# EAGLE design RedBoard-v21 (EAGLE 7.1.0)
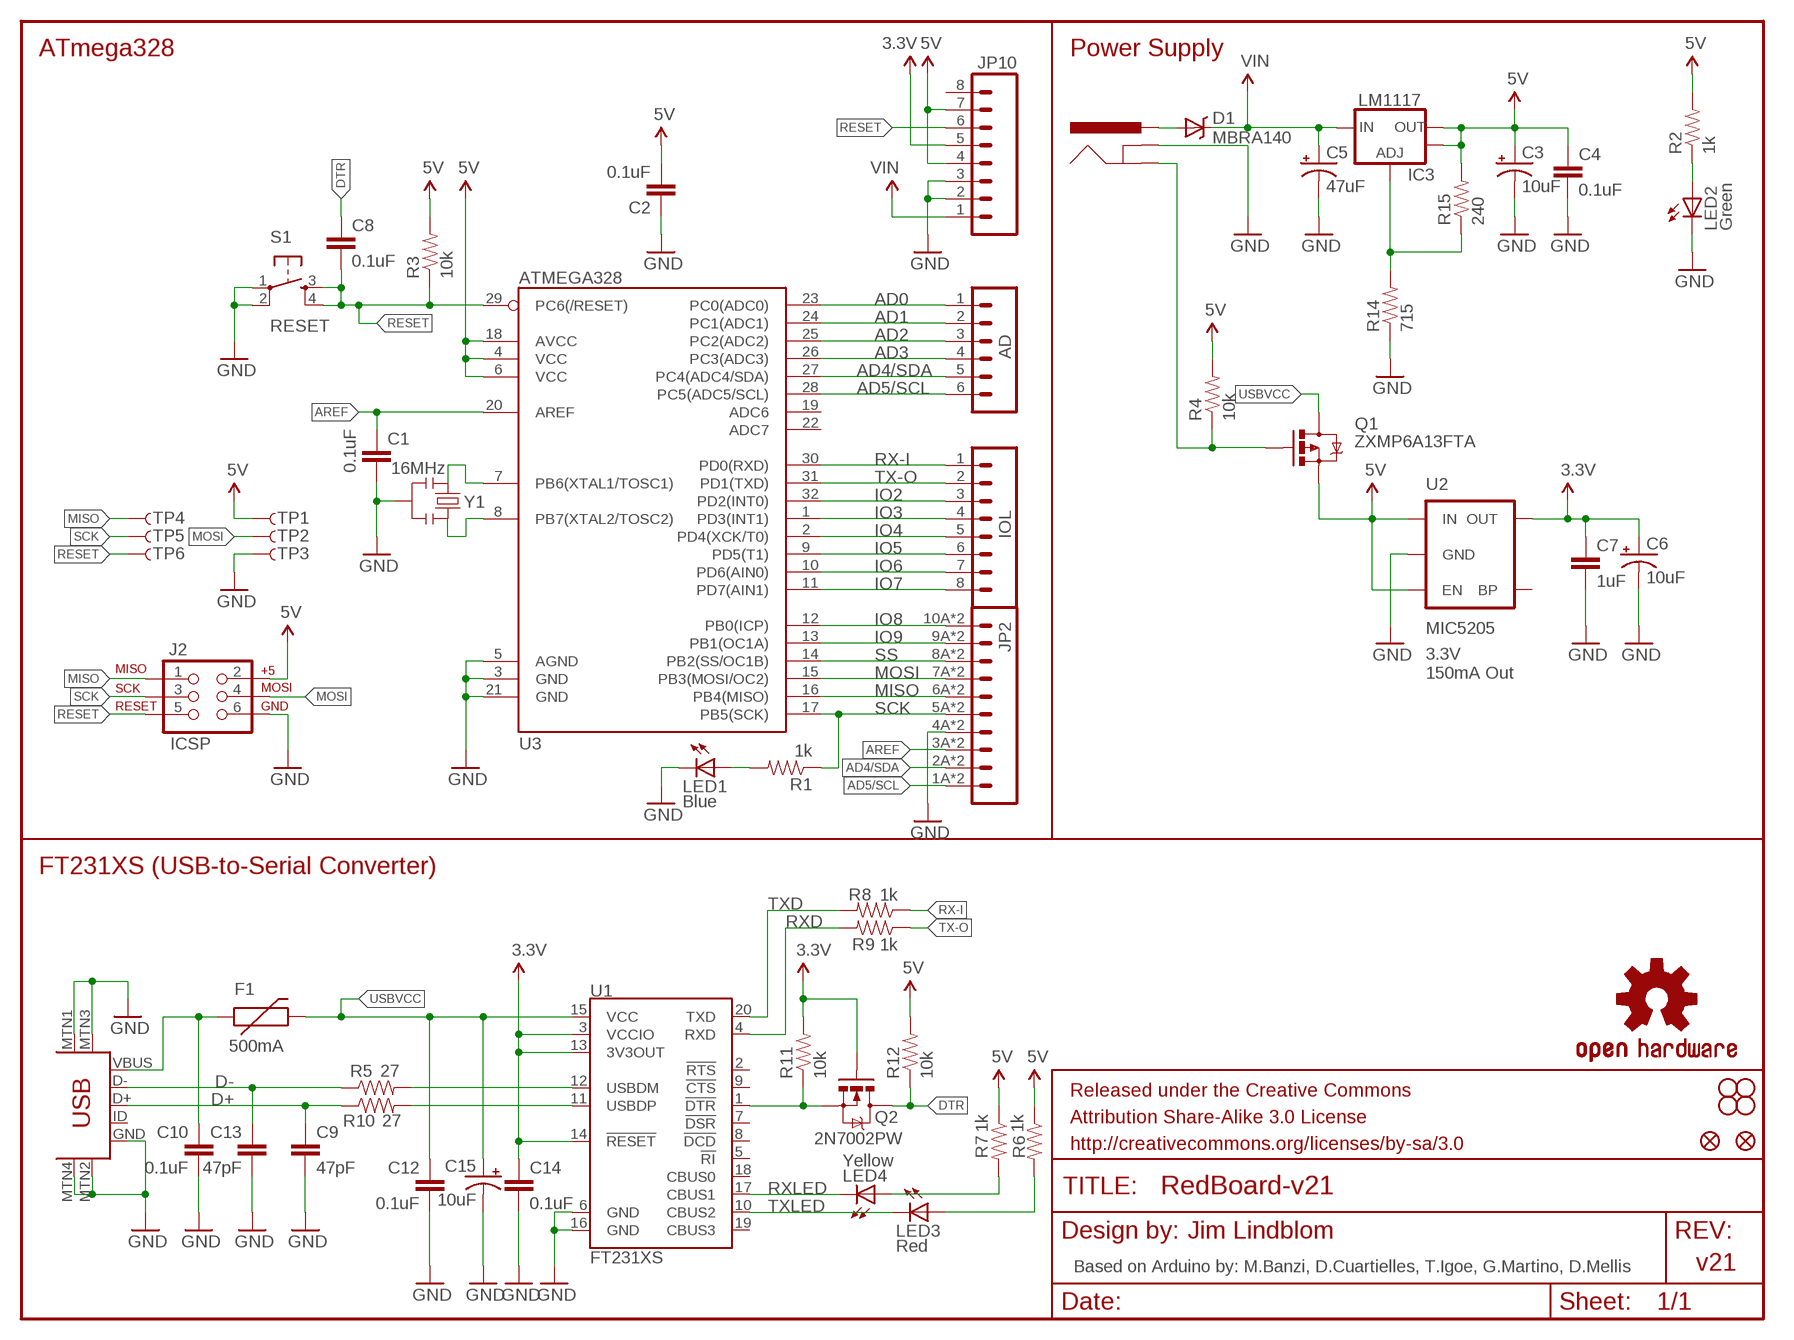
[diagram p0: schematic, sheet 1]

## Parts
AD  M06SMD-STRAIGHT-COMBO  [1X06_SMD_STRAIGHT_COMBO]
C1  0.1uF  CAP0603-CAP  [0603-CAP]
C2  0.1uF  CAP0603-CAP  [0603-CAP]
C3  10uF  CAP_POL1206  [EIA3216]
C4  0.1uF  CAP0603-CAP  [0603-CAP]
C5  47uF  CAP_POLD  [PANASONIC_D]
C6  10uF  CAP_POL1206  [EIA3216]
C7  1uF  CAP0603-CAP  [0603-CAP]
C8  0.1uF  CAP0603-CAP  [0603-CAP]
C9  47pF  47PF-50V-5%(0603)  [0603-CAP]
C10  0.1uF  CAP0603-CAP  [0603-CAP]
C12  0.1uF  CAP0603-CAP  [0603-CAP]
C13  47pF  47PF-50V-5%(0603)  [0603-CAP]
C14  0.1uF  CAP0603-CAP  [0603-CAP]
C15  10uF  CAP_POL1206  [EIA3216]
D1  MBRA140  DIODE-SCHOTTKY_  [SMA-DIODE]
F1  500mA  PTCSMD  [PTC-1206]
FRAME2  FRAME-LETTER  [CREATIVE_COMMONS]
IC3  LM1117  V_REG_LM1117ALT1  [SOT223-ALT1]
IOL  M08SMD-COMBO  [1X08_SMD_COMBINED]
J1  POWER_JACKOVERPASTE_REDBOARD_0603  [POWER_JACK_SMD_OVERPASTE_REDBOARD_0603]
J2  ICSP  AVR_SPI_PRG_6SMT_MALE  [2X3_SMT_POSTS]
JP2  M10SMD_COMBO  [1X10_SMD_COMBINED]
JP3  STAND-OFF  [STAND-OFF]
JP4  STAND-OFF  [STAND-OFF]
JP5  STAND-OFF  [STAND-OFF]
JP6  STAND-OFF  [STAND-OFF]
JP8  FIDUCIAL1X2  [FIDUCIAL-1X2]
JP9  FIDUCIAL1X2  [FIDUCIAL-1X2]
JP10  M08SMD-COMBO  [1X08_SMD_COMBINED]
LED1  Blue  LED1206-NS  [LED-1206-NO_SILK]
LED2  Green  LED1206-NS  [LED-1206-NO_SILK]
LED3  Red  LED1206-NS  [LED-1206-NO_SILK]
LED4  Yellow  LED1206-NS  [LED-1206-NO_SILK]
Q1  ZXMP6A13FTA  MOSFET-PCHANNELSMD  [SOT23-3]
Q2  2N7002PW  MOSFET-NCHANNEL2N7002PW  [SOT323]
R1  1k  RESISTOR0603-RES  [0603-RES]
R2  1k  RESISTOR0603-RES  [0603-RES]
R3  10k  RESISTOR0603-RES  [0603-RES]
R4  10k  RESISTOR0603-RES  [0603-RES]
R5  27  RESISTOR0603-RES  [0603-RES]
R6  1k  RESISTOR0603-RES  [0603-RES]
R7  1k  RESISTOR0603-RES  [0603-RES]
R8  1k  RESISTOR0603-RES  [0603-RES]
R9  1k  RESISTOR0603-RES  [0603-RES]
R10  27  RESISTOR0603-RES  [0603-RES]
R11  10k  RESISTOR0603-RES  [0603-RES]
R12  10k  RESISTOR0603-RES  [0603-RES]
R14  715  RESISTOR0603-RES  [0603-RES]
R15  240  RESISTOR0603-RES  [0603-RES]
S1  RESET  TAC_SWITCHSMD  [TACTILE_SWITCH_SMD]
TP1  TP-3x5  TEST-POINT3X5  [PAD.03X.05]
TP2  TP-3x5  TEST-POINT3X5  [PAD.03X.05]
TP3  TP-3x5  TEST-POINT3X5  [PAD.03X.05]
TP4  TP-3x5  TEST-POINT3X5  [PAD.03X.05]
TP5  TP-3x5  TEST-POINT3X5  [PAD.03X.05]
TP6  TP-3x5  TEST-POINT3X5  [PAD.03X.05]
U1  FT231XS  [SSOP20_L]
U2  MIC5205  V_REG_LDOSMD  [SOT23-5]
U3  ATMEGA328  ATMEGA168  [TQFP32-08]
U$13  USB-MINIB-5PIN  [USB-MINIB]
U$16  OSHW-LOGOS  [OSHW-LOGO-S]
Y1  16MHz  RESONATORSMD  [RESONATOR-SMD]

## Nets
3.3V: C6.A(+) C7.1 C14.1 JP10.5 Q2.1(G) R11.2 U1.3(VCCIO) U1.13(3V3OUT) U1.14(!RESET) U2.5(OUT)
5V: C2.2 C3.A(+) C4.1 IC3.2(OUT) IC3.4(OUT) J2.2 JP10.4 JP10.7 Q1.2(S) R2.2 R3.2 R4.2 R6.1 R7.1 R12.2 R15.2 TP1.P$1 U2.1(IN) U2.3(EN) U3.4(VCC) U3.6(VCC) U3.18(AVCC)
AD0: AD.1 U3.23(PC0(ADC0))
AD1: AD.2 U3.24(PC1(ADC1))
AD2: AD.3 U3.25(PC2(ADC2))
AD3: AD.4 U3.26(PC3(ADC3))
AD4/SDA: AD.5 JP2.2A JP2.2B U3.27(PC4(ADC4/SDA))
AD5/SCL: AD.6 JP2.1A JP2.1B U3.28(PC5(ADC5/SCL))
AREF: C1.1 JP2.3A JP2.3B U3.20(AREF)
D+: C9.1 R10.1 U$13.D+
D-: C13.1 R5.1 U$13.D-
DTR: C8.1 Q2.3(D) R12.1
GND: C1.2 C2.1 C3.C(-) C4.2 C5.- C6.C(-) C7.2 C9.2 C10.2 C12.2 C13.2 C14.2 C15.C(-) J1.GND(GNDBREAK) J2.6 JP2.4A JP2.4B JP10.2 JP10.3 LED1.C LED2.C R14.1 S1.1 S1.2 TP3.P$1 U1.6(GND) U1.16(GND) U2.2(GND) U3.3(GND) U3.5(AGND) U3.21(GND) U$13.GND U$13.MTN1(MTN2) U$13.MTN2(MTN3) U$13.MTN3(MTN1) U$13.MTN4 Y1.2
INSERT: J1.P$4(GND) Q1.1(G) R4.1
IO2: IOL.3 U3.32(PD2(INT0))
IO3: IOL.4 U3.1(PD3(INT1))
IO4: IOL.5 U3.2(PD4(XCK/T0))
IO5: IOL.6 U3.9(PD5(T1))
IO6: IOL.7 U3.10(PD6(AIN0))
IO7: IOL.8 U3.11(PD7(AIN1))
IO8: JP2.10A JP2.10B U3.12(PB0(ICP))
IO9: JP2.9A JP2.9B U3.13(PB1(OC1A))
MISO: J2.1 JP2.6A JP2.6B TP4.P$1 U3.16(PB4(MISO))
MOSI: J2.4 JP2.7A JP2.7B TP2.P$1 U3.15(PB3(MOSI/OC2))
N$1: LED1.A R1.2
N$2: LED2.A R2.1
N$3: U3.7(PB6(XTAL1/TOSC1)) Y1.1
N$4: U3.8(PB7(XTAL2/TOSC2)) Y1.3
N$6: R5.2 U1.12(USBDM)
N$7: R10.2 U1.11(USBDP)
N$8: LED3.A R6.2
N$10: LED4.A R7.2
N$12: Q2.2(S) R11.1 U1.1(!DTR)
N$15: IC3.1(ADJ) R14.2 R15.1
PWRIN: D1.A J1.VIN0(PWR)
RESET: C8.2 J2.5 JP10.6 R3.1 S1.3 S1.4 TP6.P$1 U3.29(PC6(/RESET))
RX-I: IOL.1 R8.1 U3.30(PD0(RXD))
RXD: R9.2 U1.4(RXD)
RXLED: LED4.C U1.17(CBUS1)
SCK: J2.3 JP2.5A JP2.5B R1.1 TP5.P$1 U3.17(PB5(SCK))
SS: JP2.8A JP2.8B U3.14(PB2(SS/OC1B))
TX-O: IOL.2 R9.1 U3.31(PD1(TXD))
TXD: R8.2 U1.20(TXD)
TXLED: LED3.C U1.10(CBUS2)
USBVCC: C12.1 C15.A(+) F1.2 Q1.3(D) U1.15(VCC)
VIN: C5.+ D1.C IC3.3(IN) JP10.1
VUSB: C10.1 F1.1 U$13.VBUS
Unconnected: JP10.8 U1.2(!RTS) U1.5(!RI) U1.7(!DSR) U1.8(!DCD) U1.9(!CTS) U1.18(CBUS0) U1.19(CBUS3) U2.4(BP) U3.19(ADC6) U3.22(ADC7) U$13.ID

## Notes on the sheet
- ATmega328 | Power Supply
- 3.3V
  150mA Out
- FT231XS (USB-to-Serial Converter)
- Jim Lindblom
- Based on Arduino by: M.Banzi, D.Cuartielles, T.Igoe, G.Martino, D.Mellis | v21

## Library data of the parts
AD = SparkFun:M06: Header 6 Standard 6-pin 0.1" header. Use with straight break away headers (SKU : PRT-00116), right angle break away headers (PRT-00553), swiss pins (PRT-00743), machine pins (PRT-00117), and female headers (PRT-00115). Molex polarized connector foot print use with SKU : PRT-08094 with associated crimp pins and housings. NOTES ON THE VARIANTS LOCK and LOCK_LONGPADS... This footprint was designed to help hold the alignment of a through-hole component (i.e. 6-pin header) while soldering it into place. You may notice that each hole has been shifted either up or down by 0.005 of an inch from it's more standard position (which is a perfectly straight line). This slight alteration caused the pins (the squares in the middle) to touch the edges of the holes. Because they are alternating, it causes a "brace" to hold the component in place. 0.005 has proven to be the perfect amount of "off-center" position when using our standard breakaway headers. Although looks a little odd when you look at the bare footprint, once you have a header in there, the alteration is very hard to notice. Also, if you push a header all the way into place, it is covered up entirely on the bottom side. This idea of altering the position of holes to aid alignment will be further integrated into the Sparkfun Library for other footprints. It can help hold any component with 3 or more connection pins.
C1 C2 C4 C7 C8 C10 C12 C14 = SparkFun:CAP: Capacitor Standard 0603 ceramic capacitor, and 0.1" leaded capacitor.
C3 C5 C6 = SparkFun:CAP_POL: Capacitor Polarized These are standard SMD and PTH capacitors. Normally 10uF, 47uF, and 100uF in electrolytic and tantalum varieties. Always verify the external diameter of the through hole cap, it varies with capacity, voltage, and manufacturer. The EIA devices should be standard.
C9 C13 = SparkFun-Capacitors:47PF-50V-5%(0603): CAP-08913; PROD_ID: CAP-08913
C15 = SparkFun-Capacitors:CAP_POL: Capacitor Polarized These are standard SMD and PTH capacitors. Normally 10uF, 47uF, and 100uF in electrolytic and tantalum varieties. Always verify the external diameter of the through hole cap, it varies with capacity, voltage, and manufacturer. The EIA devices should be standard.
D1 = SparkFun:DIODE-SCHOTTKY
F1 = SparkFun:PTC: Resettable Fuse PTC Resettable Fuse. Spark Fun Electronics SKU : COM-08357
FRAME2 = SparkFun-Aesthetics:FRAME-LETTER: Schematic Frame Standard 8.5x11 US Letter frame
IC3 = Testing:V_REG_LM1117: Voltage Regulator LM1117 Standard adjustable voltage regulator but in SMD form. Spark Fun Electronics SKU : COM-00595
IOL = SparkFun:M08: Header 8 Standard 8-pin 0.1" header. Use with straight break away headers (SKU : PRT-00116), right angle break away headers (PRT-00553), swiss pins (PRT-00743), machine pins (PRT-00117), and female headers (PRT-00115).
J1 = Testing:POWER_JACK: Power Jack This is the standard 5.5mm barrel jack for power. The PTH is the most common, proven, reliable, footprint. All others are experimental. The Slot footprint only works if the mill layer is transmitted to the PCB fab house so be warned. Spark Fun Electronics SKU : PRT-00119. Mating wall wart : TOL-00298 (and others)
J2 = SparkFun-Connectors:AVR_SPI_PRG_6: AVR ISP 6 Pin This is the reduced ISP connector for AVR programming. Common on Arduino. This footprint will take up less PCB space and can be used with a 10-pin to 6-pin adapter such as SKU: BOB-08508
JP2 = SparkFun-Connectors:M10: Header 10 Standard 10-pin 0.1" header. Use with straight break away headers (SKU : PRT-00116), right angle break away headers (PRT-00553), swiss pins (PRT-00743), machine pins (PRT-00117), and female headers (PRT-00115).
JP3-JP6 = SparkFun:STAND-OFF: Stand Off This is the mechanical footprint for a #4 phillips button head screw. Use the keepout ring to avoid running the screw head into surrounding components. SKU : PRT-00447
JP8 JP9 = SparkFun:FIDUCIAL: Fiducial Alignment Points Various fiducial points for machine vision alignment.
JP10 = SparkFun-Connectors:M08: Header 8 Standard 8-pin 0.1" header. Use with straight break away headers (SKU : PRT-00116), right angle break away headers (PRT-00553), swiss pins (PRT-00743), machine pins (PRT-00117), and female headers (PRT-00115).
LED1-LED4 = SparkFun-LED:LED: LEDs Standard schematic elements and footprints for 5mm, 3mm, 1206, and 0603 sized LEDs. 5mm - Spark Fun Electronics SKU : COM-00529 (and others)
Q1 = SparkFun:MOSFET-PCHANNEL
Q2 = SparkFun-DiscreteSemi:MOSFET-NCHANNEL: Common NMOSFET Parts MFG P/N Store ID Prod ID FDD8780 TRANS-09984 SI7820DN TRANS-11055 FDS6630A IC-08089 2N7002PW TRANS-11151 FQP30N06L COM-10213 TRANS-10060 BSS123LT1G TRANS-08345 BSS138 TRANS-00830 BS170 2N7000; PROD_ID: TRANS-11151
R1-R4 R6-R9 R11 R12 R14 R15 = SparkFun:RESISTOR: Resistor Basic schematic elements and footprints for 0603, 1206, and PTH resistors.
R5 R10 = SparkFun-Resistors:RESISTOR: Resistor Basic schematic elements and footprints for 0603, 1206, and PTH resistors.
S1 = SparkFun:TAC_SWITCH: Momentary Switch Button commonly used for reset or general input. Spark Fun Electronics SKU : COM-00097
TP1-TP6 = SparkFun-Passives:TEST-POINT: Bare copper test points for troubleshooting or ICT
U1 = SparkFun-DigitalIC:FT231X: FTDI FT231X Full Speed USB to Full-handshake UART This USB2.0 Full Speed IC offers a compact bridge to full handshake UART interfaces. The device is a UART, capable of operating up to 3MBaud, with low power consumption (8mA). The FT231X includes the complete FT-X series feature set and enables USB to be added into a system design quickly and easily over a UART interface.
U2 = SparkFun:V_REG_LDO: Voltage Regulator LDO Standard 150mA LDO voltage regulator in SOT-23 layout. Micrel part MIC5205. BP (by-pass) pin is used to lower output noise with 470pF cap.
U3 = SparkFun:ATMEGA168
U$13 = SparkFun-Connectors:USB-MINIB: Mini-USB "B" connector with 5th pin broken out. Created new symbol breaking out 5th "ID" pin in mini/micro USB connector spec. See: http://en.wikipedia.org/wiki/Mini_usb#Cables. Uses same footprint as 4-pin symbol. Also added pins to connect to mounting / shield pads if required (probably not generally needed as signals aren't shielded once they leave the connector).
U$16 = SparkFun-Aesthetics:OSHW-LOGO: Open Source Hardware Logo This logo indicates the piece of hardware it is found on incorporates a OSHW license and/or adheres to the definition of open source hardware found here: http://freedomdefined.org/OSHW
Y1 = SparkFun-FreqCtrl:RESONATOR: Resonator Small SMD resonator. This is the itty bitty 10/20MHz resonators with built in caps. CSTCE10M0G55 and CSTCE20M0V53. Footprint has been reviewed closely but hasn't been tested yet.

## Net classes
0 default: width 0.152 mm, drill 0.305 mm, clearance 0.152 mm

## Board
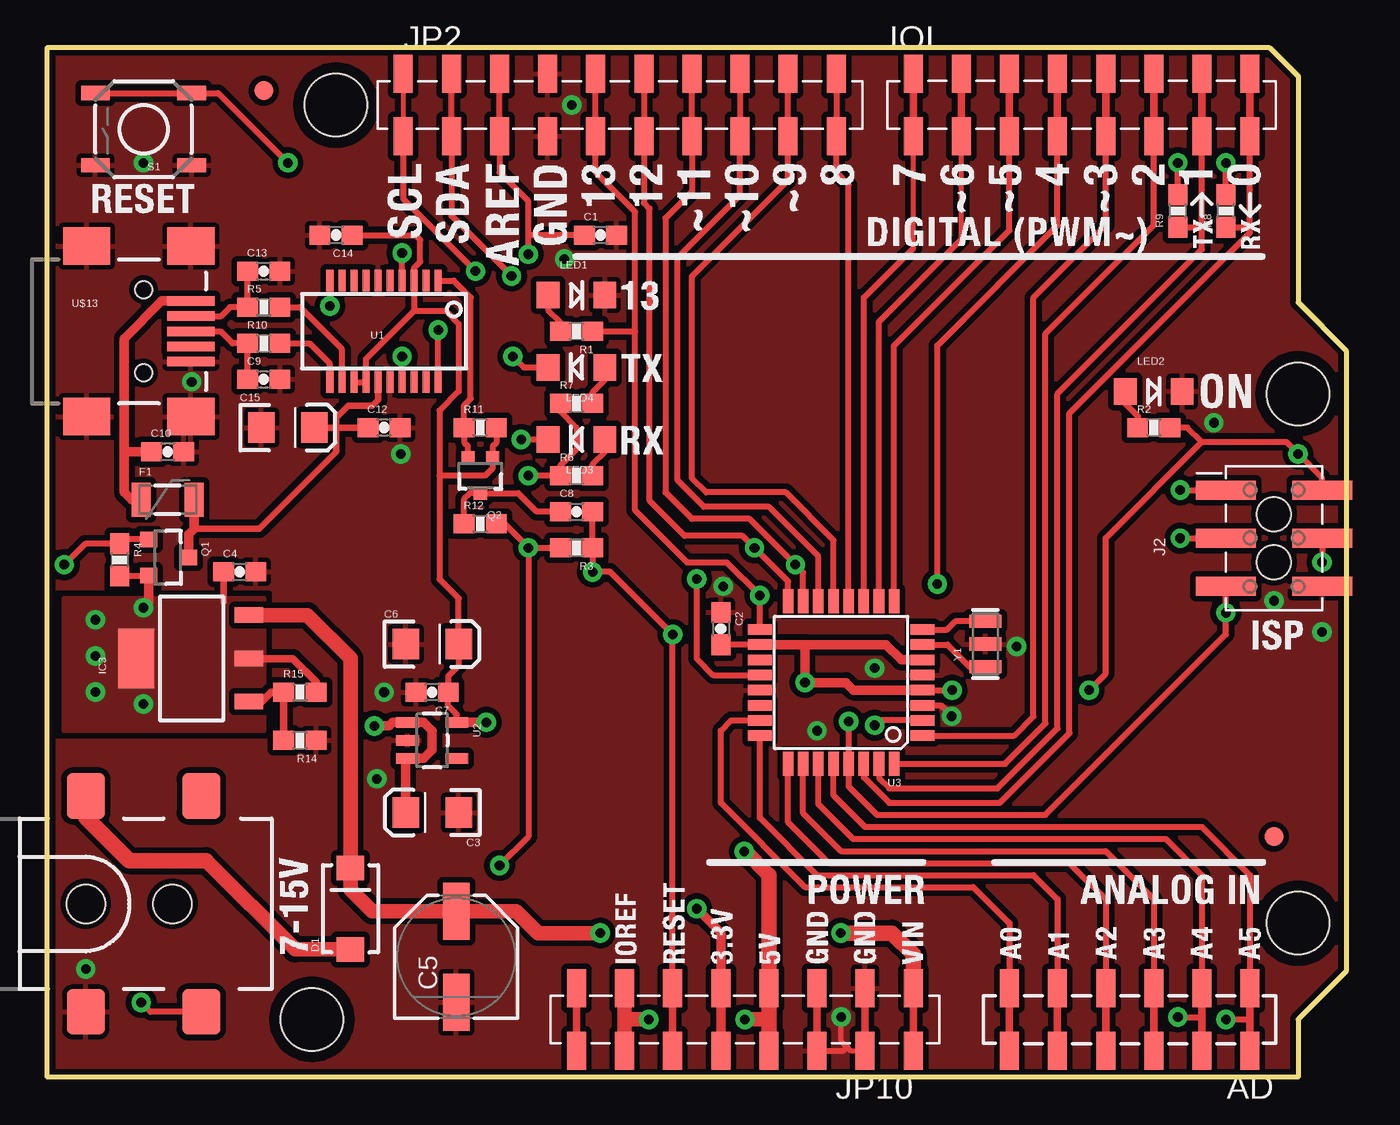
[diagram p1: board, top side]
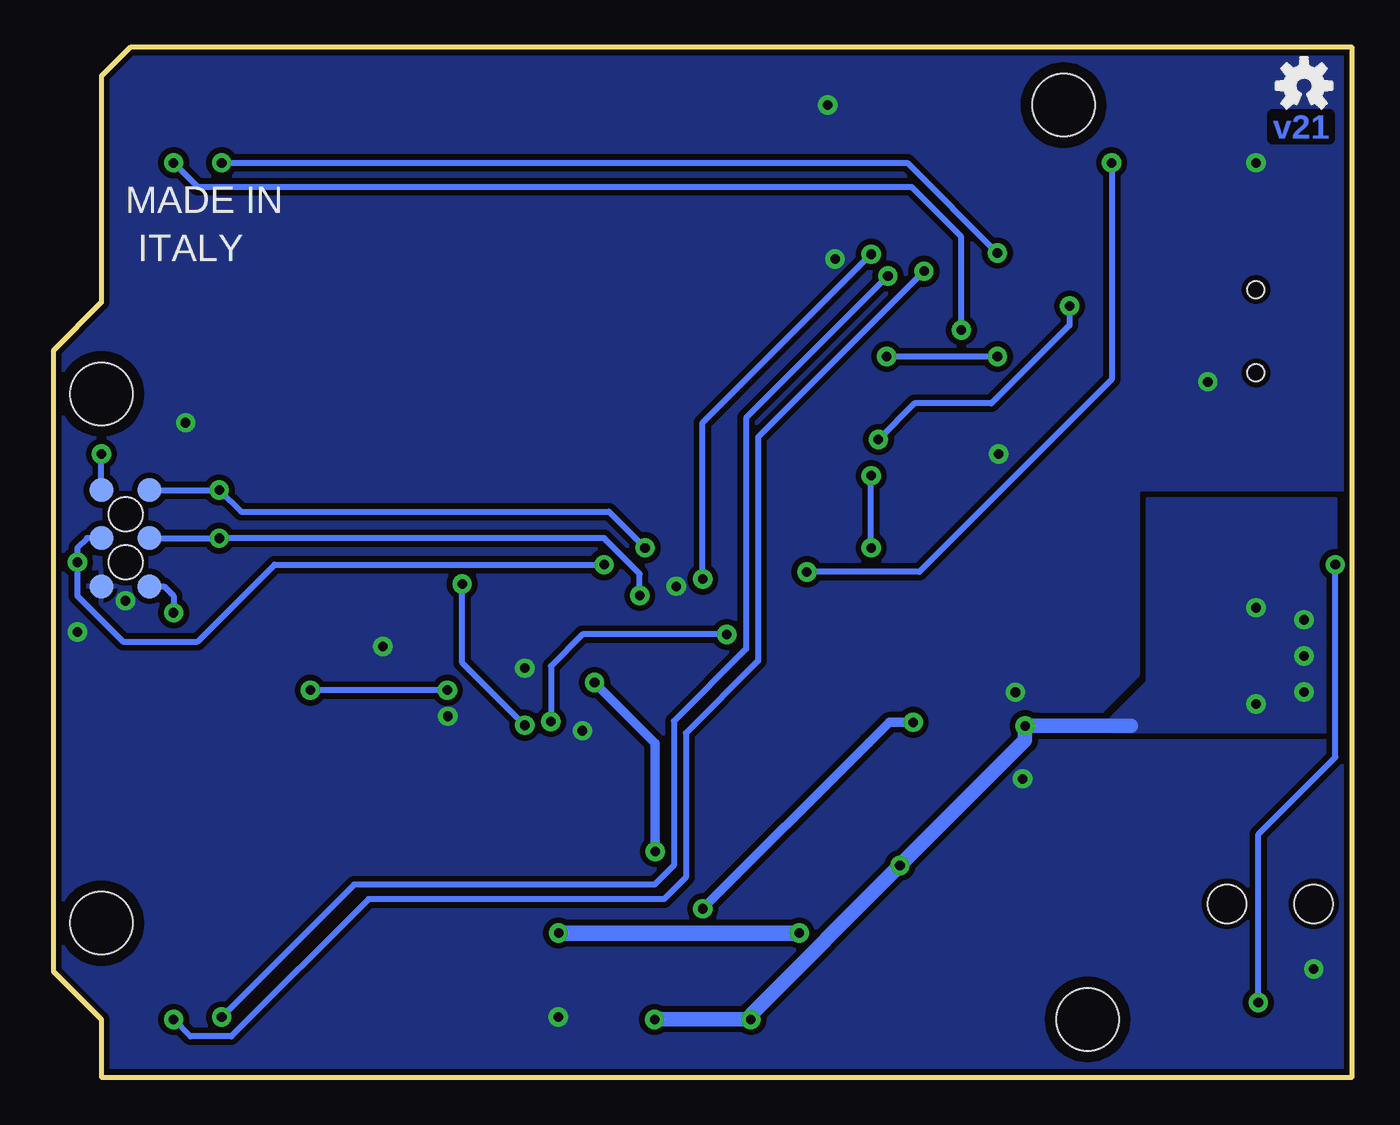
[diagram p2: board, bottom side, seen from below]

Size 68.58 x 54.36 mm. Coordinates in mm from the lower left corner, seen from the top.
Outline: 0,54.36 64.52,54.36 66.04,52.83 66.04,40.89 68.58,38.35 68.58,5.59 66.04,3.05 66.04,0 0,0 0,54.36
Copper layers (1*16): Top 0.035mm / dielectric 1.5mm / Bottom 0.035mm
Design rules "SparkFun-2-layer": minimum track width 7mil, minimum drill 15mil, track to track 8mil, track to pad 8mil, pad to pad 8mil, via to via 8mil, smd to smd 8mil, copper to edge 8mil, drill to drill 8mil, minimum pad ring 12mil, minimum via ring 10mil, stop-mask expansion 4mil, vias tented up to drill 20mil, thermal gap 10mil
vRestrict: area 0.6,22.4 to 2,30.6; area 5.7,23.1 to 7.4,30.6; area 47.9,10.8 to 48.5,11.3; area 50.4,10.7 to 50.9,11.6; area 11.3,29.3 to 12.7,31.6; area 0.3,13 to 9.4,25

### Footprints (pad centres in the part's own frame; a part is rotated, then mirrored left to right if it is on the bottom)
1X06_SMD_STRAIGHT_COMBO = smd 1 x 2: 1 0,1.65; 1-2 0,-1.65; 2 -2.54,-1.65; 2-2 -2.54,1.65; 3 -5.08,1.65; 3-2 -5.08,-1.65; 4 -7.62,-1.65; 4-2 -7.62,1.65; 5 -10.16,1.65; 5-2 -10.16,-1.65; 6 -12.7,-1.65; 6-2 -12.7,1.65
0603-CAP = smd 1.1 x 1: 1 -0.85,0; 2 0.85,0
EIA3216 = smd 1.4 x 1.6: A 1.4,0; C -1.4,0
PANASONIC_D = smd 3 x 1.4: + 2.4,0; - -2.4,0
SMA-DIODE = smd 1.27 x 1.47: A -2.15,0; C 2.15,0
PTC-1206 = smd 1 x 1.8: 1 -1.4,0; 2 1.4,0
SOT223-ALT1 = smd 0.813 x 1.524: 1 -2.271,-3.02; 2 0,-3.02; 3 2.288,-3.02 | smd 3.124 x 1.905: 4 0,2.921
1X08_SMD_COMBINED = smd 1 x 2: 1 0,-1.65; 1@2 0,1.65; 2 -2.54,1.65; 2@2 -2.54,-1.65; 3 -5.08,-1.65; 3@2 -5.08,1.65; 4 -7.62,1.65; 4@2 -7.62,-1.65; 5 -10.16,-1.65; 5@2 -10.16,1.65; 6 -12.7,1.65; 6@2 -12.7,-1.65; 7 -15.24,-1.65; 7@2 -15.24,1.65; 8 -17.78,1.65; 8@2 -17.78,-1.65
POWER_JACK_SMD_OVERPASTE_REDBOARD_0603 = smd 2 x 2.4: GND 0,-5.7; P$4 6.1,-5.7; VIN0 0,5.7; VIN1 6.1,5.7 | hole 2.032: 0,0; 4.572,0
2X3_SMT_POSTS = smd 1 x 3.17: 1 -2.54,-2.54; 2 -2.54,2.54; 3 0,-2.54; 4 0,2.54; 5 2.54,-2.54; 6 2.54,2.54 | hole 1.8: -1.27,0; 1.27,0
1X10_SMD_COMBINED = smd 1 x 2: 1A 0,1.65; 1B 0,-1.65; 2A 2.54,1.65; 2B 2.54,-1.65; 3A 5.08,1.65; 3B 5.08,-1.65; 4A 7.62,1.65; 4B 7.62,-1.65; 5A 10.16,1.65; 5B 10.16,-1.65; 6A 12.7,1.65; 6B 12.7,-1.65; 7A 15.24,1.65; 7B 15.24,-1.65; 8A 17.78,1.65; 8B 17.78,-1.65; 9A 20.32,1.65; 9B 20.32,-1.65; 10A 22.86,1.65; 10B 22.86,-1.65
STAND-OFF = hole 3.302: 0,0
FIDUCIAL-1X2 = smd 1 x 1: 1 0,0
1X08_SMD_COMBINED' = smd 1 x 2: 1 0,1.65; 1@2 0,-1.65; 2 2.54,-1.65; 2@2 2.54,1.65; 3 5.08,1.65; 3@2 5.08,-1.65; 4 7.62,-1.65; 4@2 7.62,1.65; 5 10.16,1.65; 5@2 10.16,-1.65; 6 12.7,-1.65; 6@2 12.7,1.65; 7 15.24,1.65; 7@2 15.24,-1.65; 8 17.78,-1.65; 8@2 17.78,1.65
LED-1206-NO_SILK = smd 1.2 x 1.4: A -1.5,0; C 1.5,0
SOT23-3 = smd 0.8 x 0.9: 1 -0.95,-1; 2 0.95,-1; 3 0,1.1
SOT323 = smd 0.7 x 0.7: 1 -0.65,-0.925; 2 0.65,-0.925; 3 0,0.925
0603-RES = smd 1.1 x 1: 1 -0.85,0; 2 0.85,0
TACTILE_SWITCH_SMD = smd 1.524 x 0.762: 1 -2.54,1.905; 2 2.54,1.905; 3 -2.54,-1.905; 4 2.54,-1.905
PAD.03X.05 = smd 1.27 x 1.27: P$1 0,0
SSOP20_L = smd 0.381 x 1.143: 1 -2.857,-2.68; 2 -2.223,-2.68; 3 -1.587,-2.68; 4 -0.953,-2.68; 5 -0.318,-2.68; 6 0.318,-2.68; 7 0.953,-2.68; 8 1.587,-2.68; 9 2.223,-2.68; 10 2.857,-2.68; 11 2.857,2.68; 12 2.223,2.68; 13 1.587,2.68; 14 0.953,2.68; 15 0.318,2.68; 16 -0.318,2.68; 17 -0.953,2.68; 18 -1.587,2.68; 19 -2.223,2.68; 20 -2.857,2.68
SOT23-5 = smd 0.55 x 1.2: 1 -0.95,-1.3; 2 0,-1.3; 3 0.95,-1.3; 4 0.95,1.3; 5 -0.95,1.3
TQFP32-08 = smd 1.27 x 0.559: 1 -4.293,2.8; 2 -4.293,2; 3 -4.293,1.2; 4 -4.293,0.4; 5 -4.293,-0.4; 6 -4.293,-1.2; 7 -4.293,-2; 8 -4.293,-2.8; 17 4.293,-2.8; 18 4.293,-2; 19 4.293,-1.2; 20 4.293,-0.4; 21 4.293,0.4; 22 4.293,1.2; 23 4.293,2; 24 4.293,2.8 | smd 0.559 x 1.27: 9 -2.8,-4.293; 10 -2,-4.293; 11 -1.2,-4.293; 12 -0.4,-4.293; 13 0.4,-4.293; 14 1.2,-4.293; 15 2,-4.293; 16 2.8,-4.293; 25 2.8,4.293; 26 2,4.293; 27 1.2,4.293; 28 0.4,4.293; 29 -0.4,4.293; 30 -1.2,4.293; 31 -2,4.293; 32 -2.8,4.293
USB-MINIB = smd 2.5 x 0.5: D+ 2.5,0; D- 2.5,0.8; GND 2.5,-1.6; ID 2.5,-0.8; VBUS 2.5,1.6 | smd 2.5 x 2: MTN1 -3,4.5; MTN2 2.5,4.5; MTN3 -3,-4.5; MTN4 2.5,-4.5 | hole 0.9: 0,2.2; 0,-2.2
RESONATOR-SMD = smd 0.7 x 1.7: 1 -1.2,0; 2 0,0; 3 1.2,0

### Placement (x,y rotation side)
AD  50.8,3.05 180 top
C1  29.21,44.45 0 top
C2  35.56,23.68 270 top
C3  20.32,13.97 180 top
C4  10.16,26.67 0 top
C5  21.59,6.35 90 top
C6  20.32,22.86 0 top
C7  20.32,20.32 180 top
C8  27.94,29.84 0 top
C9  11.43,36.83 0 top
C10  6.35,33.02 0 top
C12  17.78,34.29 0 top
C13  11.43,42.55 0 top
C14  15.24,44.45 180 top
C15  12.7,34.29 0 top
D1  16,8.89 90 top
F1  6.35,30.48 0 top
FRAME2  2.54,-24.13 0 top  (outside the outline)
IC3  7.62,22.1 90 top
IOL  63.5,51.31 0 top
J1  2.03,9.14 0 top
J2  64.77,28.45 270 top
JP2  18.8,51.31 0 top
JP3  13.97,3.05 0 top
JP4  66.04,8.13 0 top
JP5  66.04,36.07 0 top
JP6  15.24,51.31 0 top
JP8  64.77,12.7 0 top
JP9  11.43,52.07 0 top
JP10  [1X08_SMD_COMBINED']  45.72,3.05 180 top
LED1  27.94,41.27 0 top
LED2  58.42,36.2 0 top
LED3  27.94,33.66 180 top
LED4  27.94,37.47 180 top
Q1  6.35,27.43 270 top
Q2  22.86,31.75 180 top
R1  27.94,39.37 180 top
R2  58.42,34.29 0 top
R3  27.94,27.94 180 top
R4  3.81,27.3 270 top
R5  11.43,40.64 0 top
R6  27.94,31.75 0 top
R7  27.94,35.56 0 top
R8  62.23,45.72 90 top
R9  59.69,45.72 90 top
R10  11.43,38.73 0 top
R11  22.86,34.29 0 top
R12  22.86,29.21 0 top
R14  13.34,17.78 180 top
R15  13.34,20.32 0 top
S1  5.08,50.04 180 top
TP1  66.04,30.99 0 bottom
TP2  66.04,28.45 0 bottom
TP3  66.04,25.91 0 bottom
TP4  63.5,30.99 0 bottom
TP5  63.5,28.45 0 bottom
TP6  63.5,25.91 0 bottom
U1  17.78,39.37 180 top
U2  20.32,17.78 270 top
U3  41.91,20.83 180 top
U$13  5.08,39.37 0 top
U$16  2.54,52.32 0 bottom
Y1  49.53,22.86 90 top

### Tracks (layer width: path | path; a pad name or v marks a point on that pad's centre or on a via)
3.3V  (via drill 0.51)
  Top 0.305: U2.5 21.62,19.15 21.17,19.6 C7.1 21.17,21.17 21.72,21.72 C6.A 21.72,25.27 20.7,26.29 20.7,31.75 | R11.2 23.71,33.49 23.51,33.29 Q2.1 23.51,32.15 23.11,31.75 20.7,31.75 | 19.37,40.45 U1.3 19.37,42.74 19.68,43.05 19.68,44.2 19.43,44.45 C14.1 | U1.13 U1.14 16.83,37.91 19.37,40.45 | 19.37,40.45 21.02,40.45 21.72,39.75 21.72,36.2 20.7,35.18 20.7,31.75
  Top 0.508: JP10.5 35.56,7.62 v34.29,8.89 | U2.5 v23.18,18.73
  Bottom 0.508: v34.29,8.89 25.53,17.65 25.52,17.65 24.45,18.73 v23.18,18.73
5V  (via drill 0.51)
  Top 0.305: U3.18 C2.2 | U3.4 v47.77,20.43 | 60.96,33.53 65.41,33.53 v66.04,32.89 67.31,31.62 J2.2 | JP10.4 38.1,2.54 | 60.96,33.53 55.88,28.45 55.88,21.3 v55.01,20.43 | 60.96,33.53 60.2,34.29 R2.2 | v25.4,27.94 25.4,12.7 v23.88,11.18 | v25.4,31.75 R6.1 27.09,32.3 27.94,33.15 27.94,34.29 27.09,35.14 R7.1 | v25.4,27.94 R3.2 | R4.2 5.32,26.45 Q1.2 | R12.2 24.13,29.21 v25.4,27.94
  Top 0.356: C4.1 9.31,25.06
  Top 0.406: IC3.2 12.95,22.1 14.19,20.87 R15.2 | C3.A 19.05,13.97
  Top 0.508: U3.6 45.09,22.03 44.28,22.83 40.01,22.83 | 40.01,22.83 U3.18 | 40.01,22.83 v40.01,20.83 42.16,20.83 42.56,20.43 U3.4 | C3.A 18.92,16.73 U2.3 19.88,16.83 20.32,17.27 20.32,18.29 19.88,18.73 U2.1 18.22,18.73 18.03,18.54 v17.27,18.54 | Q1.2 5.35,25.05 v5.08,24.78
  Top 0.762: v36.8,11.91 36.8,11.97 38.1,10.67 | v36.83,3.05 37.85,3.05 38.1,3.3 | v31.75,3.05 30.48,3.05 | 30.48,3.05 JP10.7 | 30.48,4.7 30.48,3.05
  Top 0.813: 38.1,10.67 JP10.4 38.1,3.3 38.1,2.54 38.1,1.4
  Bottom 0.305: v47.77,20.43 v55.01,20.43 | v25.4,27.94 v25.4,31.75 | TP1.P$1 v66.04,32.89
  Bottom 0.508: v36.8,11.91 36.8,17.62 v40.01,20.83
  Bottom 0.762: v36.83,3.05 v31.75,3.05 31.75,3.3 v23.88,11.18 17.27,17.78 v17.27,18.54 | v17.27,18.54 11.68,18.54 | 16.51,18.54 v17.27,18.54
  other vias: 2.54,22.24 5.08,19.7 2.54,20.33 2.54,24.14
  pour Bottom (isolate 0.305, no thermals): 0.89,30.48 10.79,30.48 10.79,20.83 12.7,18.92 12.7,18.29 0.89,18.29
  pour Top (isolate 0.305, no thermals): 0.89,18.29 0.89,25.27 11.43,25.27 11.43,18.29
AD0
  Top 0.305: U3.23 36.1,18.83 35.56,18.29 35.56,14.48 40.01,10.03 48.9,10.03 50.8,8.13 AD.1
AD1
  Top 0.305: U3.24 37.62,13.69 40.64,10.67 52.07,10.67 53.34,9.4 AD.2
AD2
  Top 0.305: U3.25 39.11,13.47 41.27,11.3 53.98,11.3 55.88,9.4 AD.3
AD3
  Top 0.305: U3.26 39.91,13.94 41.91,11.94 55.88,11.94 58.42,9.4 AD.4
AD4/SDA  (via drill 0.51)
  Top 0.305: U3.27 40.71,14.41 42.55,12.57 59.05,12.57 60.96,10.67 60.96,3.17 | 60.96,3.17 AD.5 | v24.51,42.29 21.34,45.47 JP2.2B JP2.2A | v59.69,3.17 60.96,3.17
  Bottom 0.305: v59.69,3.17 52.7,10.16 36.83,10.16 35.81,11.18 35.81,18.8 32,22.61 32,34.8 v24.51,42.29
AD5/SCL  (via drill 0.51)
  Top 0.254: JP2.1A JP2.1B
  Top 0.305: U3.28 41.51,14.88 43.18,13.21 60.96,13.21 63.5,10.67 AD.6 63.5,3.05 v62.23,3.05 | JP2.1B 18.8,46.35 v22.61,42.55
  Bottom 0.305: v22.61,42.55 31.37,33.78 31.37,21.97 35.18,18.16 35.18,10.54 36.32,9.4 51.94,9.4 59.18,2.16 61.34,2.16 v62.23,3.05
AREF  (via drill 0.51)
  Top 0.305: U3.20 35.16,21.23 34.29,22.1 v34.29,26.29 | JP2.3A JP2.3B 23.88,47.75 25.4,46.23 25.4,44.45 | v25.4,43.43 25.4,44.45 | C1.1 25.4,44.45
  Bottom 0.305: v25.4,43.43 34.29,34.54 v34.29,26.29
D+
  Top 0.305: R10.1 10.58,38.95 | U$13.D+ 9.14,39.37 9.78,38.73 R10.1 | C9.1 R10.1
D-
  Top 0.305: U$13.D- 9.18,40.17 9.65,40.64 R5.1 C13.1
DTR
  Top 0.305: R12.1 22.01,30.52 22.32,30.82 Q2.3 24.86,30.82 25.84,29.84 C8.1
GND  (via drill 0.51)
  Top 0.254: 43.18,1.4 42.42,1.4 42.23,1.59 41.91,1.91 v41.91,3.17
  Top 0.305: U3.3 47.17,19.63 v47.75,19.05 | JP10.3 42.04,1.4 42.23,1.59
  other vias: 5.08,48.26 61.59,34.54 40.64,18.29 27.69,51.31 43.69,21.59 51.18,22.73 35.69,25.91 2.03,5.71 7.62,36.7 27.3,43.18 67.31,23.5 18.67,32.89 64.77,25.15 17.78,20.32 17.4,15.75
  pour Top (isolate 0.305, rank 2): 0,54.36 64.52,54.36 66.04,52.83 66.04,40.89 68.58,38.35 68.58,5.59 66.04,3.05 66.04,0 0,0
  pour Bottom (isolate 0.305, rank 2): 0,54.36 64.52,54.36 66.04,52.83 66.04,40.89 68.58,38.35 68.58,5.59 66.04,3.05 66.04,0 0,0
INSERT  (via drill 0.51)
  Top 0.305: J1.P$4 5.45,3.44 v4.95,3.94 | Q1.1 4.04,28.38 R4.1 1.99,28.16 v0.89,27.05
  Bottom 0.305: v4.95,3.94 4.95,12.83 0.89,16.89 v0.89,27.05
IO2
  Top 0.305: IOL.3 58.42,44.96 52.7,39.24 52.7,18.67 50.57,16.54 U3.32
IO3
  Top 0.305: IOL.4 55.88,44.96 52.07,41.15 52.07,19.05 51.05,18.03 U3.1
IO4  (via drill 0.51)
  Top 0.305: v46.99,26.04 46.99,38.61 53.34,44.96 IOL.5 | U3.2 43.94,18.83 v43.69,18.57
  Bottom 0.305: v43.69,18.57 46.99,21.88 v46.99,26.04
IO5
  Top 0.305: U3.9 44.71,38.61 50.8,44.7 IOL.6
IO6
  Top 0.254: 48.26,44.23 IOL.7
  Top 0.305: U3.10 43.91,39.88 48.26,44.23
IO7
  Top 0.254: 45.72,43.76 IOL.8
  Top 0.305: U3.11 43.11,41.15 45.72,43.76
IO8
  Top 0.305: U3.12 42.31,47.1 41.66,47.75 JP2.10B JP2.10A
IO9
  Top 0.305: JP2.9A JP2.9B 39.12,47.35 34.04,42.27 34.04,31.62 34.8,30.86 38.99,30.86 41.51,28.34 U3.13
MISO  (via drill 0.51)
  Top 0.305: U3.16 39.11,26.17 v37.34,27.94 36.7,28.57 33.66,28.57 31.8,30.43 31.8,45.85 31.5,46.15 JP2.6B JP2.6A | v59.82,30.99 J2.1
  Bottom 0.305: v37.34,27.94 39.24,29.84 58.67,29.84 v59.82,30.99 TP4.P$1
MOSI  (via drill 0.51)
  Top 0.305: U3.15 39.91,26.64 v39.5,27.05 37.08,29.46 34.04,29.46 32.64,30.86 32.64,45.34 34.04,46.74 JP2.7B JP2.7A | J2.4 v67.31,27.18
  Bottom 0.305: v39.5,27.05 56.9,27.05 60.96,22.99 64.9,22.99 67.31,25.4 v67.31,27.18 67.31,27.94 66.8,28.45 TP2.P$1
N$1
  Top 0.305: R1.2 27.09,39.84 26.44,40.49 LED1.A
N$2
  Top 0.356: R2.1 57.57,34.89 56.92,35.54 LED2.A
N$3
  Top 0.305: U3.7 47.53,22.83 48.7,21.66 Y1.1
N$4
  Top 0.305: U3.8 47.5,23.63 47.94,24.06 Y1.3
N$6
  Top 0.305: R5.2 13.34,40.64 15.56,38.42 U1.12
N$7
  Top 0.305: U1.11 14.92,37.66 13.84,38.73 R10.2
N$8
  Top 0.305: R6.2 28.79,32.35 29.44,33 LED3.A
N$10
  Top 0.305: LED4.A 29.44,36.81 28.79,36.16 R7.2
N$12
  Top 0.305: Q2.2 22.21,33.29 22.01,33.49 R11.1 22.01,35.47 22.35,35.81 22.35,41.15 21.45,42.05 U1.1
N$15
  Top 0.406: IC3.1 11.32,19.83 11.81,20.32 R15.1 R14.2
PWRIN
  Top 0.762: D1.A 13.07,6.74 8.38,11.43
  Top 0.813: 8.38,11.43 4.32,11.43 2.03,13.72 J1.VIN0
RESET  (via drill 0.51)
  Top 0.305: v42.31,18.78 U3.29 42.31,15.35 43.81,13.84 52.7,13.84 62.23,23.37 v62.23,24.51 J2.5 62.99,25.91 | S1.4 S1.3 9.02,51.94 v12.7,48.26 | 33.02,1.4 JP10.6 v33.02,23.37 29.72,26.67 v28.79,26.67 R3.1 C8.2
  Bottom 0.305: v42.31,18.78 42.31,21.7 40.64,23.37 v33.02,23.37 | v12.7,48.26 12.7,36.83 22.86,26.67 v28.79,26.67 | TP6.P$1 62.74,25.91 62.23,25.4 v62.23,24.51
RX-I
  Top 0.254: 63.5,46.86 63.52,46.88
  Top 0.305: 63.5,44.83 63.5,44.58 53.98,35.05 53.98,18.16 50.29,14.48 44.45,14.48 43.11,15.82 U3.30 | 63.5,44.83 63.5,46.86 IOL.1 | R8.1 63.46,44.87 63.5,44.83
RXD  (via drill 0.51)
  Top 0.305: R9.2 v59.69,48.26 | U1.4 v18.73,43.5
  Bottom 0.305: v59.69,48.26 23.5,48.26 v18.73,43.5
RXLED  (via drill 0.51)
  Top 0.305: U1.17 v18.73,38.04 | v24.57,38.04 25.15,37.47 LED4.C
  Bottom 0.305: v18.73,38.04 v24.57,38.04
SCK  (via drill 0.51)
  Top 0.305: U3.17 v37.62,25.43 35.87,27.18 33.78,27.18 31.04,29.92 31.04,39.37 | JP2.5A JP2.5B 28.96,47.75 31.04,45.67 31.04,39.37 | R1.1 31.04,39.37 | v59.82,28.45 J2.3
  Bottom 0.305: v37.62,25.43 37.62,26.57 39.5,28.45 v59.82,28.45 TP5.P$1
SS
  Top 0.305: U3.14 40.71,27.49 38.1,30.1 34.67,30.1 33.27,31.5 33.27,43.25 36.58,46.55 JP2.8B JP2.8A
TX-O
  Top 0.254: 60.96,46.86 60.95,46.88
  Top 0.305: U3.31 43.91,15.78 44.45,15.24 50.16,15.24 53.34,18.41 53.34,36.07 60.96,43.69 60.96,44.83 | 60.96,44.83 60.96,46.86 IOL.2 | R9.1 60.92,44.87 60.96,44.83
TXD  (via drill 0.51)
  Top 0.305: R8.2 v62.23,48.26 | U1.20 v20.64,39.43
  Bottom 0.305: v62.23,48.26 60.96,46.99 23.27,46.99 20.64,44.36 v20.64,39.43
TXLED  (via drill 0.51)
  Top 0.305: U1.10 v14.92,40.7 | LED3.C v25.02,33.66
  Bottom 0.305: v14.92,40.7 14.92,39.69 19.05,35.56 23.11,35.56 v25.02,33.66
USBVCC
  Top 0.356: C15.A 15.24,34.29 | U1.15 17.46,35.75 17.14,35.43 15.88,35.43 15.24,34.8 15.24,34.29 | C12.1 15.24,34.29 | 7.75,28.96 11.18,28.96 15.24,33.02 15.24,34.29
  Top 0.508: F1.2 7.75,28.96 7.45,28.66 Q1.3
VIN  (via drill 0.51)
  Top 0.305: JP10.1 45.72,4.7
  Top 0.762: v29.2,7.61 25.9,7.61 24.76,8.75 C5.+ 17.16,8.75 16,9.91 D1.C 16,22.1 13.72,24.39 IC3.3
  Top 0.813: v41.9,7.61 44.59,7.61 45.72,6.48 45.72,4.7
  Bottom 0.813: v29.2,7.61 v41.9,7.61
VUSB
  Top 0.508: 4.06,33.02 4.06,38.99 6.04,40.97 U$13.VBUS | C10.1 4.06,33.02 | 4.06,33.02 4.06,30.86 4.45,30.48 F1.1

### Text on the board
Bottom: v21
bNames: MADE IN | ITALY
tDocu: J.Lindblom
214bmp: D:/SmartProjects/Snc/a4_bn_logo2.bmp